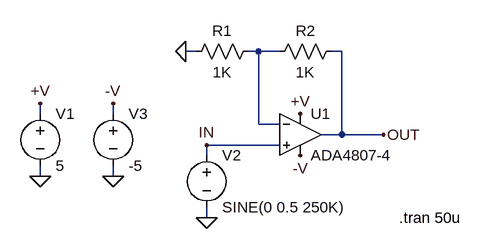
[diagram p0: schematic ADA4807-4.asc]
ADA4807-4.asc, the LTspice schematic file:
Version 4
SHEET 1 1240 700
WIRE 416 -1232 400 -1232
WIRE 512 -1232 496 -1232
WIRE 544 -1232 512 -1232
WIRE 640 -1232 624 -1232
WIRE 176 -1136 176 -1152
WIRE 288 -1136 288 -1152
WIRE 512 -1120 512 -1232
WIRE 544 -1120 512 -1120
WIRE 640 -1104 640 -1232
WIRE 640 -1104 608 -1104
WIRE 704 -1104 640 -1104
WIRE 544 -1088 432 -1088
WIRE 432 -1072 432 -1088
WIRE 176 -1040 176 -1056
WIRE 288 -1040 288 -1056
WIRE 432 -976 432 -992
FLAG 176 -1152 +V
FLAG 176 -1040 0
FLAG 432 -976 0
FLAG 704 -1104 OUT
FLAG 432 -1088 IN
FLAG 576 -1136 +V
FLAG 288 -1152 -V
FLAG 288 -1040 0
FLAG 400 -1232 0
FLAG 576 -1072 -V
SYMBOL voltage 176 -1152 R0
SYMATTR InstName V1
SYMATTR Value 5
SYMBOL voltage 432 -1088 R0
WINDOW 123 24 146 Left 2
WINDOW 39 24 125 Left 2
SYMATTR InstName V2
SYMATTR Value SINE(0 0.5 250K)
SYMBOL res 512 -1248 R90
WINDOW 0 0 56 VBottom 2
WINDOW 3 32 56 VTop 2
SYMATTR InstName R1
SYMATTR Value 1K
SYMBOL res 640 -1248 R90
WINDOW 0 0 56 VBottom 2
WINDOW 3 32 56 VTop 2
SYMATTR InstName R2
SYMATTR Value 1K
SYMBOL voltage 288 -1152 R0
SYMATTR InstName V3
SYMATTR Value -5
SYMBOL opamps\\ADA4807-4 576 -1168 R0
SYMATTR InstName U1
TEXT 728 -976 Left 2 !.tran 50u

The netlist it stands for:
* ADA4807-4.asc
V1 +V 0 5
V2 IN 0 SINE(0 0.5 250K)
R1 N001 0 1K
R2 OUT N001 1K
V3 -V 0 -5
XU1 IN N001 +V -V OUT ADA4807-4  ; pins In+ In- V+ V- OUT
.tran 50u
.backanno
.end